# Altium schematic sheet TCRT5000_SMT.SchDoc
size A4
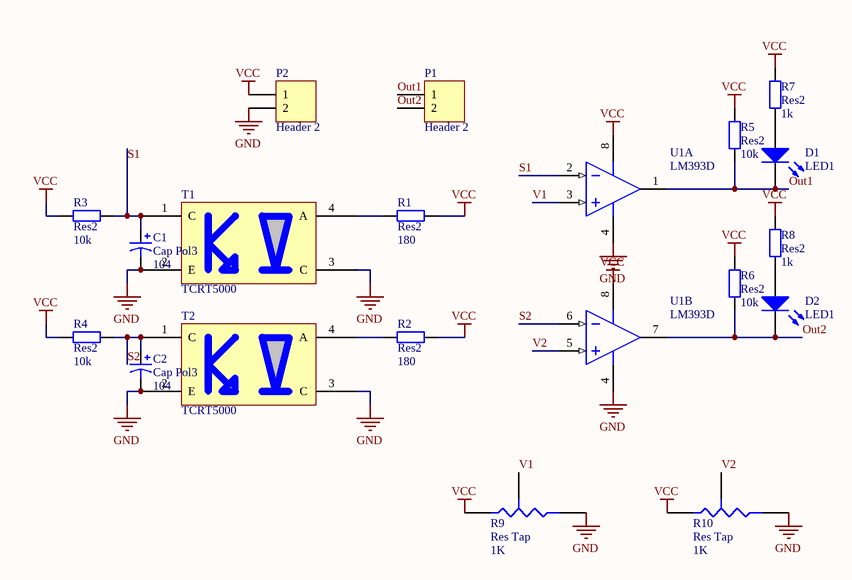
[diagram p0: TCRT5000_SMT.SchDoc]

## Parts
C1  Cap Pol3  value 104  [0805C]
C2  Cap Pol3  value 104  [0805C]
D1  LED1  [0603L]
D2  LED1  [0603L]
P1  Header 2  [HDR1X2]
P2  Header 2  [HDR1X2]
R1  Res2  value 180  [0805R]
R2  Res2  value 180  [0805R]
R3  Res2  value 10k  [0805R]
R4  Res2  value 10k  [0805R]
R5  Res2  value 10k  [0805R]
R6  Res2  value 10k  [0805R]
R7  Res2  value 1k  [0805R]
R8  Res2  value 1k  [0805R]
R9  Res Tap  value 1K  [VR4-2]
R10  Res Tap  value 1K  [VR4-2]
T1  TCRT5000  [DIP-4N]
T2  TCRT5000  [DIP-4N]
U1  LM393D  [SO8_N]  (parts A,B of 2)

## Nets
GND: C1.2 C2.2 P2.2 R9.2(B) R10.2(B) T1.2(E) T1.3(C) T2.2(E) T2.3(C) U1.4(V-)
VCC: P2.1 R1.2 R2.2 R3.1 R4.1 R5.1 R6.1 R7.1 R8.1 R9.1(A) R10.1(A) U1.8(V+)
Out1: D1.2(K) P1.1 R5.2 U1.1(OUT)
Out2: D2.2(K) P1.2 R6.2 U1.7(OUT)
S1: C1.1 R3.2 T1.1(C) U1.2(IN-)
S2: C2.1 R4.2 T2.1(C) U1.6(IN-)
V1: R9.3(TAP) U1.3(IN+)
V2: R10.3(TAP) U1.5(IN+)
NetD1_1: D1.1(A) R7.2
NetD2_1: D2.1(A) R8.2
NetR1_1: R1.1 T1.4(A)
NetR2_1: R2.1 T2.4(A)

## Library data of the parts
C1 C2 = Cap Pol3: Polarized Capacitor (Surface Mount); Published: 8-Jun-2000; LatestRevisionDate: 29-May-2009; LatestRevisionNote: IPC-7351 Footprint Added.; PackageReference: C0805; Publisher: Altium Limited; PackageDescription: Chip Capacitor
D1 D2 = LED1: Typical RED GaAs LED; Published: 8-Jun-2000; LatestRevisionDate: 08-Jul-2005; LatestRevisionNote: Mech Layer 1 removed.; PackageReference: LED-1; Publisher: Altium Limited; PackageDescription: LED; 2 Leads
P1 P2 = Header 2: Header, 2-Pin; LatestRevisionDate: 17-Jul-2002; LatestRevisionNote: Re-released for DXP Platform.; Publisher: Altium Limited
R1-R8 = Res2: Resistor; Published: 8-Jun-2000; LatestRevisionDate: 17-Jul-2002; LatestRevisionNote: Re-released for DXP Platform.; PackageReference: AXIAL-0.4; Publisher: Altium Limited
R9 R10 = Res Tap: Tapped Resistor; pin to pad: 2>3 3>2; Sim Note: Enter the Resistance value and the set point into parameter fields.; Set Position: 0.5; Published: 24-Mar-1999; LatestRevisionDate: 17-Jul-2002; LatestRevisionNote: Re-released for DXP Platform.; PackageReference: VR3; Publisher: Altium Limited; PackageDescription: Variable Resistor, Thru-Hole; 3 Leads
U1 = LM393D: Low-Power Dual Voltage Comparator; Published: 24-Aug-2001; LatestRevisionDate: 13-Apr-2006; LatestRevisionNote: IPC-7351 Footprint Added.; DatasheetVersion: Jun-1998; PackageVersion: Dec-2002; PackageReference: SO8; Publisher: Altium Limited; PackageDescription: 8-Pin Small Outline Integrated Circuit 1.27 mm Pitch; Code_JEDEC: MS-012-AA; Code_IPC: SOIC127P600-8; ComponentLink1Description: Manufacturer Link; ComponentLink1URL: http://www.st.com/; ComponentLink2Description: Datasheet; ComponentLink2URL: http://www.st.com/stonline/products/literature/ds/2164/lm293.pdf